# EAGLE design mainbrdV2 (EAGLE 5.10)
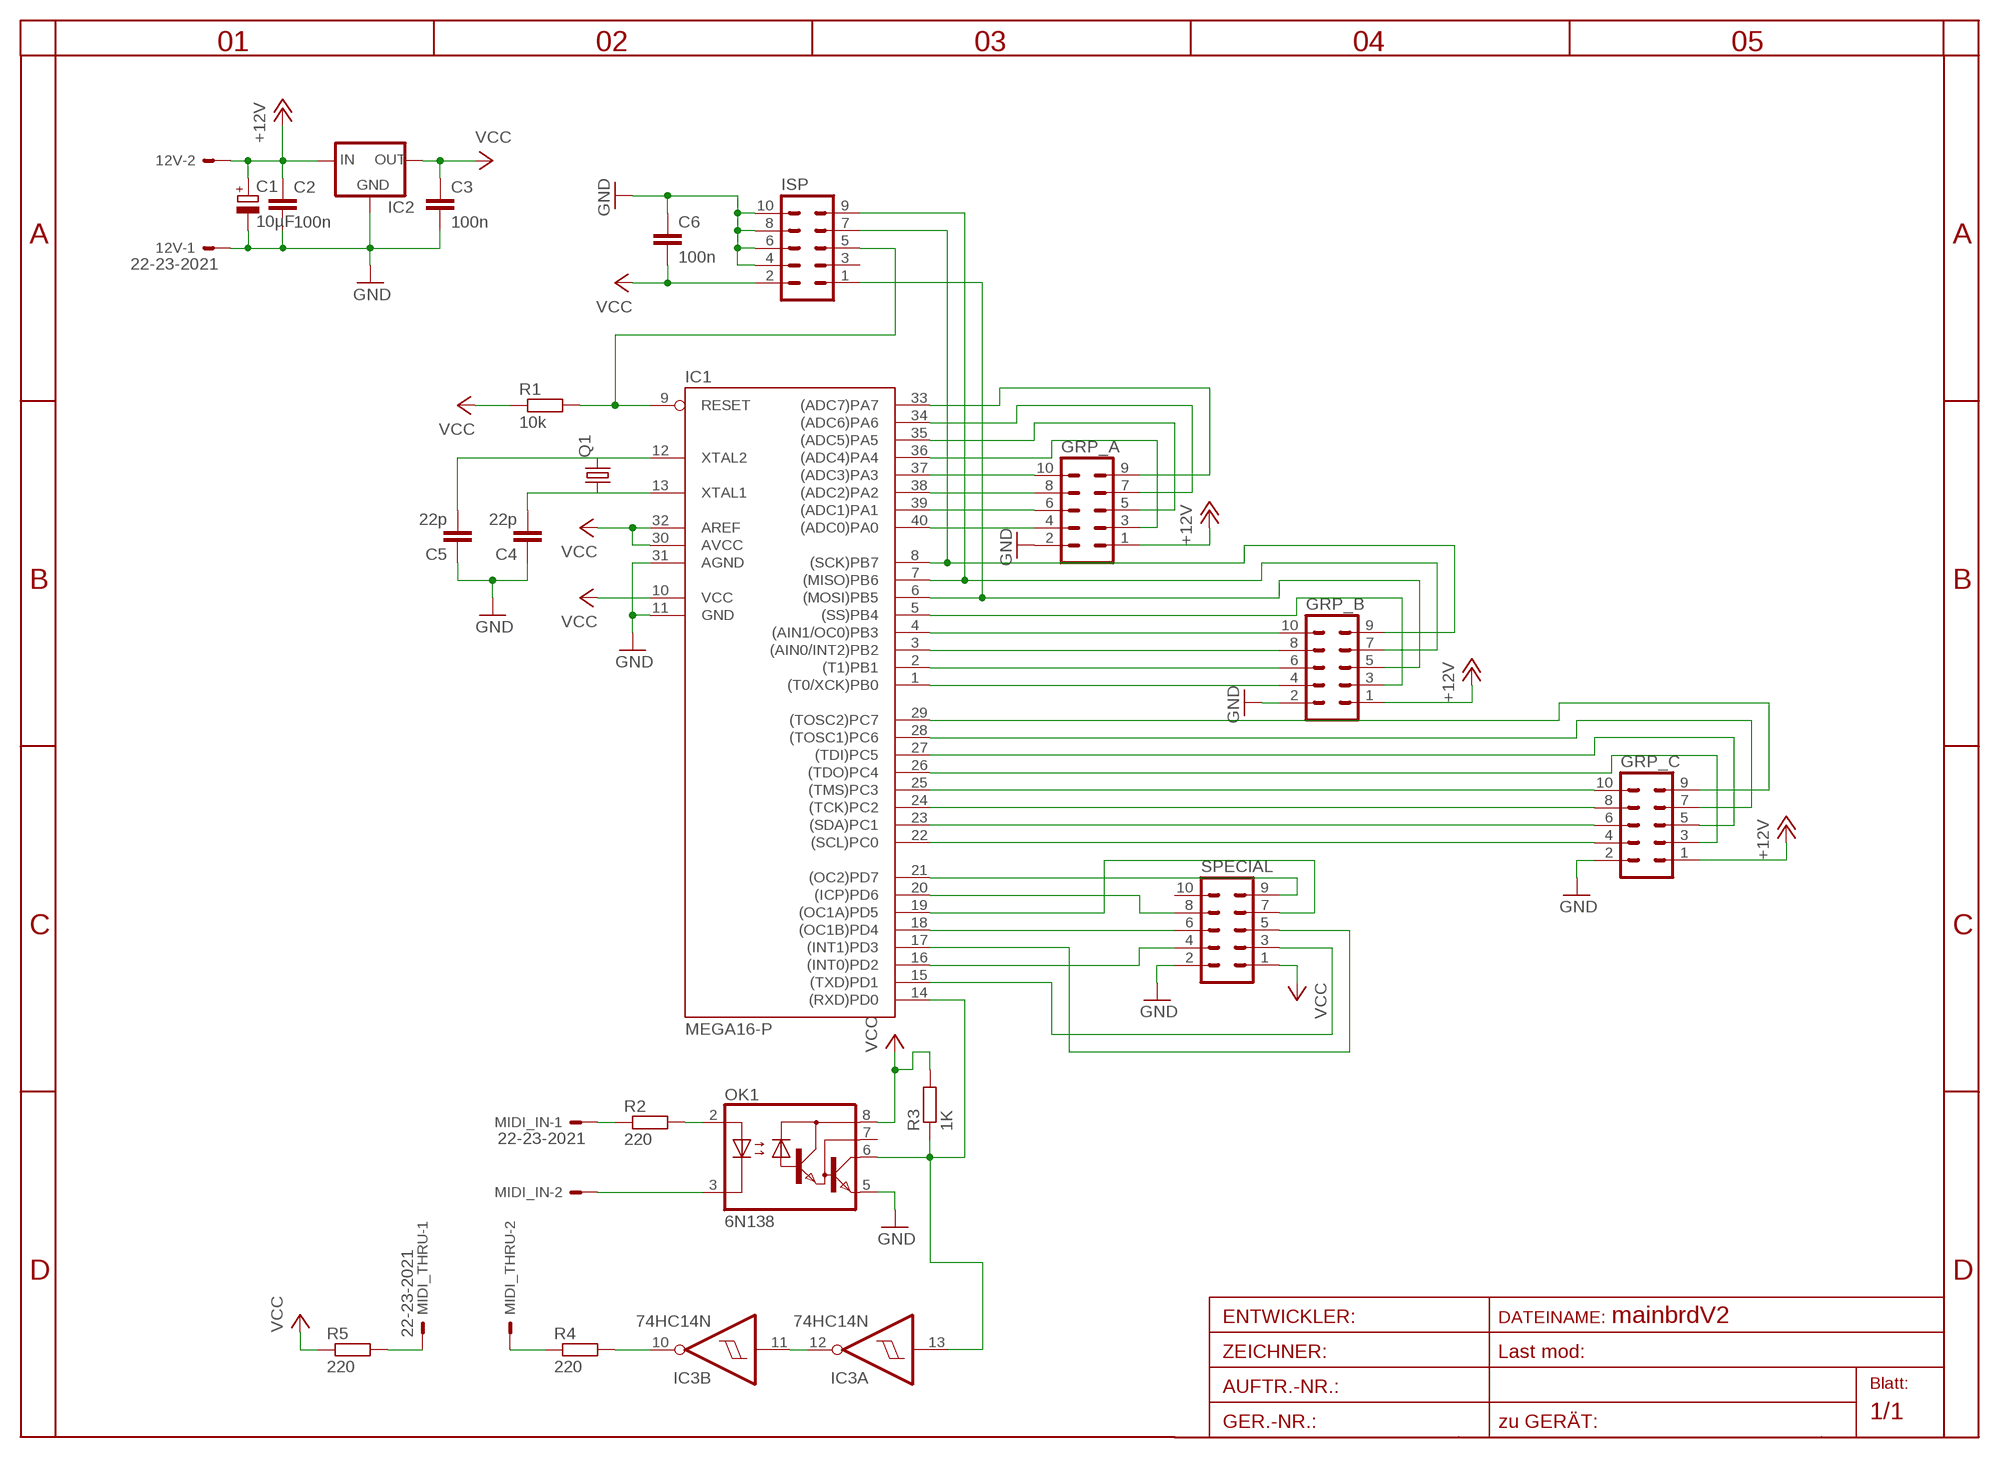
[diagram p0: schematic, sheet 1]

## Parts
12V  22-23-2021  [22-23-2021]
C1  10µF  CPOL-EUE2.5-6  [E2,5-6]
C2  100n  C-EU025-024X044  [C025-024X044]
C3  100n  C-EU025-024X044  [C025-024X044]
C4  22p  C-EU025-024X044  [C025-024X044]
C5  22p  C-EU025-024X044  [C025-024X044]
C6  100n  C-EU025-024X044  [C025-024X044]
GRP_A  ML10  [ML10]
GRP_B  ML10  [ML10]
GRP_C  ML10  [ML10]
IC1  MEGA16-P  [DIL40]
IC2  78XXL  [78XXL]
IC3  74HC14N  [DIL14]
ISP  ML10  [ML10]
MIDI_IN  22-23-2021  [22-23-2021]
MIDI_THRU  22-23-2021  [22-23-2021]
OK1  6N138  [DIL08]
Q1  CRYSTALHC49S  [HC49/S]
R1  10k  R-EU_0207/10  [0207/10]
R2  220  R-EU_M1206  [M1206]
R3  1K  R-EU_M1206  [M1206]
R4  220  R-EU_0207/12  [0207/12]
R5  220  R-EU_0207/10  [0207/10]
SPECIAL  ML10  [ML10]

## Nets
+12V: 12V.2 C1.+ C2.1 GRP_A.1 GRP_B.1 GRP_C.1 IC2.IN
GND: 12V.1 C1.- C2.2 C3.2 C4.1 C5.1 C6.1 GRP_A.2 GRP_B.2 GRP_C.2 IC1.11(GND) IC1.31(AGND) IC2.GND ISP.4 ISP.6 ISP.8 ISP.10 OK1.5(GND) SPECIAL.2
N$1: IC1.9(RESET) ISP.5 R1.2
N$2: GRP_B.9 IC1.8((SCK)PB7) ISP.7
N$3: GRP_B.7 IC1.7((MISO)PB6) ISP.9
N$4: C5.2 IC1.12(XTAL2) Q1.2
N$5: C4.2 IC1.13(XTAL1) Q1.1
N$6: GRP_B.5 IC1.6((MOSI)PB5) ISP.1
N$7: GRP_A.4 IC1.40((ADC0)PA0)
N$8: GRP_A.6 IC1.39((ADC1)PA1)
N$9: GRP_A.8 IC1.38((ADC2)PA2)
N$10: GRP_A.10 IC1.37((ADC3)PA3)
N$11: GRP_A.3 IC1.36((ADC4)PA4)
N$12: GRP_A.5 IC1.35((ADC5)PA5)
N$13: GRP_A.7 IC1.34((ADC6)PA6)
N$14: GRP_A.9 IC1.33((ADC7)PA7)
N$15: GRP_B.4 IC1.1((T0/XCK)PB0)
N$16: GRP_B.6 IC1.2((T1)PB1)
N$17: GRP_B.8 IC1.3((AIN0/INT2)PB2)
N$18: GRP_B.10 IC1.4((AIN1/OC0)PB3)
N$19: GRP_B.3 IC1.5((SS)PB4)
N$20: GRP_C.4 IC1.22((SCL)PC0)
N$21: GRP_C.6 IC1.23((SDA)PC1)
N$22: GRP_C.8 IC1.24((TCK)PC2)
N$23: GRP_C.10 IC1.25((TMS)PC3)
N$24: GRP_C.3 IC1.26((TDO)PC4)
N$25: GRP_C.5 IC1.27((TDI)PC5)
N$26: GRP_C.7 IC1.28((TOSC1)PC6)
N$27: GRP_C.9 IC1.29((TOSC2)PC7)
N$28: MIDI_IN.1 R2.1
N$29: OK1.2(A) R2.2
N$30: MIDI_IN.2 OK1.3(C)
N$31: IC1.14((RXD)PD0) IC3.13(A:I) OK1.6(VO) R3.1
N$32: IC1.15((TXD)PD1) SPECIAL.3
N$33: IC1.16((INT0)PD2) SPECIAL.4
N$34: IC1.18((OC1B)PD4) SPECIAL.6
N$35: IC1.20((ICP)PD6) SPECIAL.8
N$36: IC1.21((OC2)PD7) SPECIAL.9
N$37: IC1.19((OC1A)PD5) SPECIAL.7
N$38: IC1.17((INT1)PD3) SPECIAL.5
N$39: IC3.11(B:I) IC3.12(A:O)
N$40: IC3.10(B:O) R4.2
N$41: MIDI_THRU.1 R5.2
N$42: MIDI_THRU.2 R4.1
VCC: C3.1 C6.2 IC1.10(VCC) IC1.30(AVCC) IC1.32(AREF) IC2.OUT ISP.2 OK1.8(VCC) R1.1 R3.2 R5.1 SPECIAL.1
Unconnected: IC3.1(D:I) IC3.2(D:O) IC3.3(E:I) IC3.4(E:O) IC3.5(F:I) IC3.6(F:O) IC3.8(C:O) IC3.9(C:I) ISP.3 OK1.7(VB) SPECIAL.10

## Power pins joined to a net without a drawn wire
GND: IC3.7(P:GND)
VCC: IC3.14(P:VCC)

## Library data of the parts
12V MIDI_IN MIDI_THRU = con-molex:22-23-2021: .100" (2.54mm) Center Header - 2 Pin
C1 = rcl:CPOL-EU: POLARIZED CAPACITOR, European symbol
C2-C6 = rcl:C-EU: CAPACITOR, European symbol
GRP_A GRP_B GRP_C ISP SPECIAL = con-harting-ml:ML10: HARTING
IC1 = atmel:MEGA16-P: MICROCONTROLLER 16 Kbytes FLASH 1 kbytes SRAM 512 bytes EEPROM USART 8-channel 10 bit ADC Source: avr.lbr
IC2 = v-reg:78XXL: VOLTAGE REGULATOR
IC3 = 74xx-eu:74*14: Hex schmitt trigger INVERTER
OK1 = optocoupler:6N138: MOTOROLA OPTO COUPLER
Q1 = crystal:CRYSTAL: CRYSTAL
R1-R5 = rcl:R-EU_: RESISTOR, European symbol

## Net classes
0 default: width 0.508 mm, drill 0.051 mm, clearance 0.127 mm
1 GND: width 0.762 mm

## Board
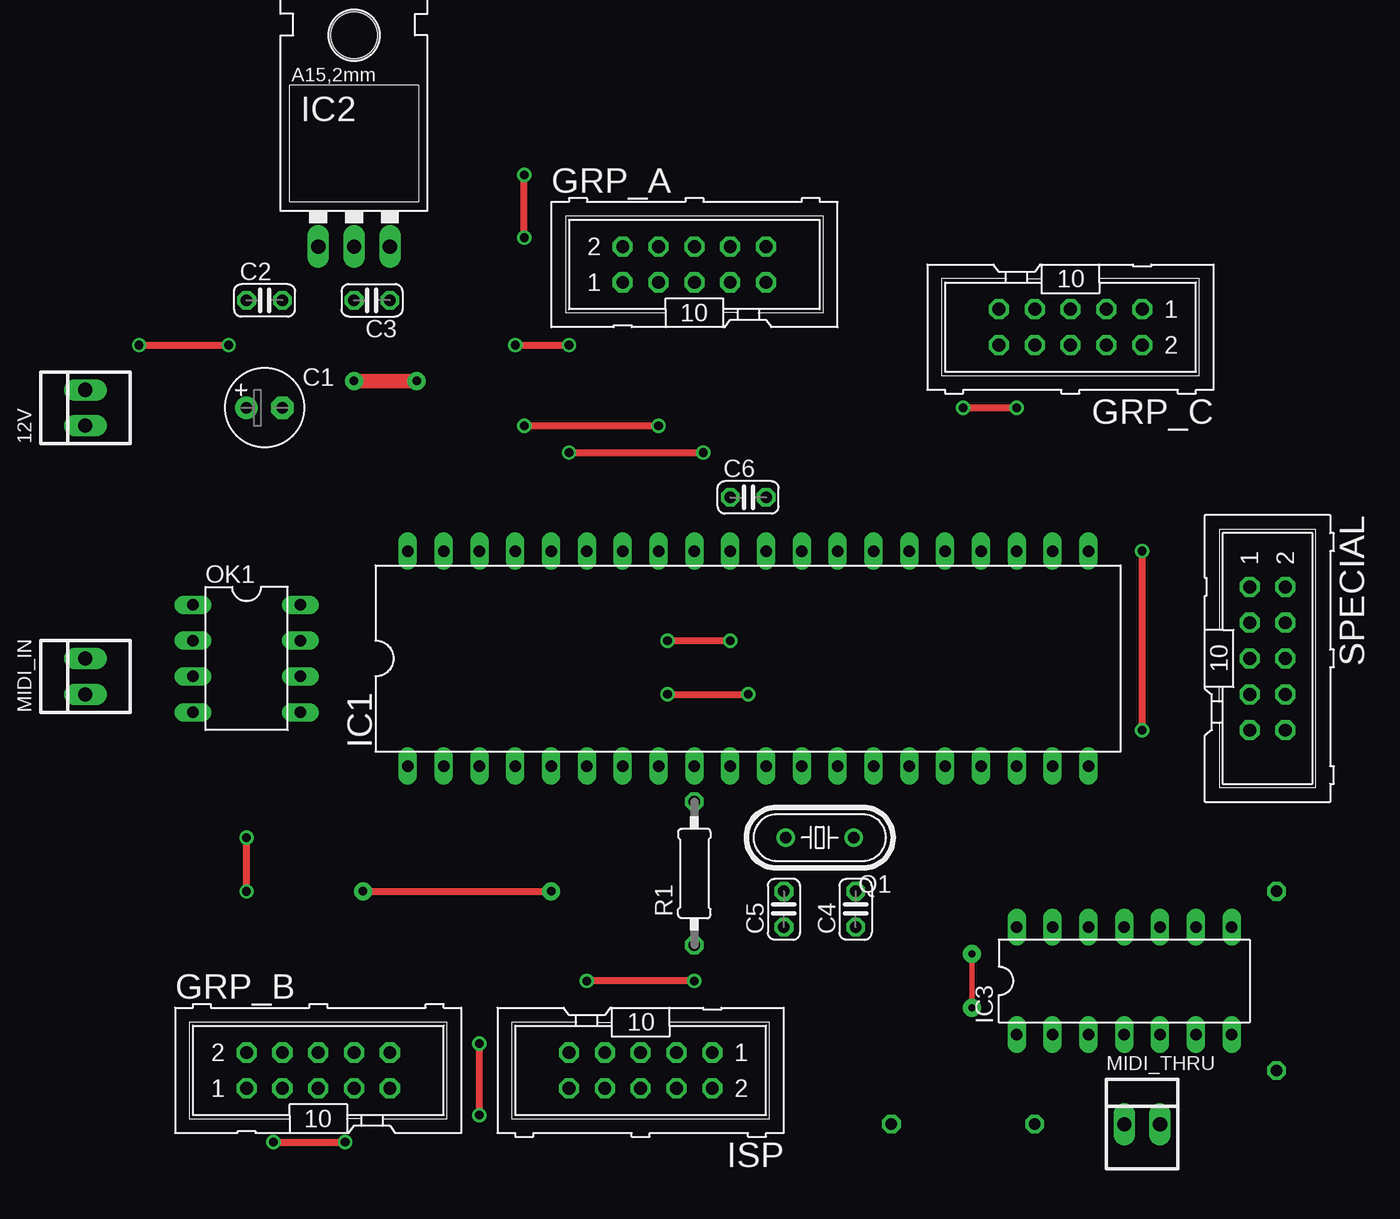
[diagram p1: board, top side]
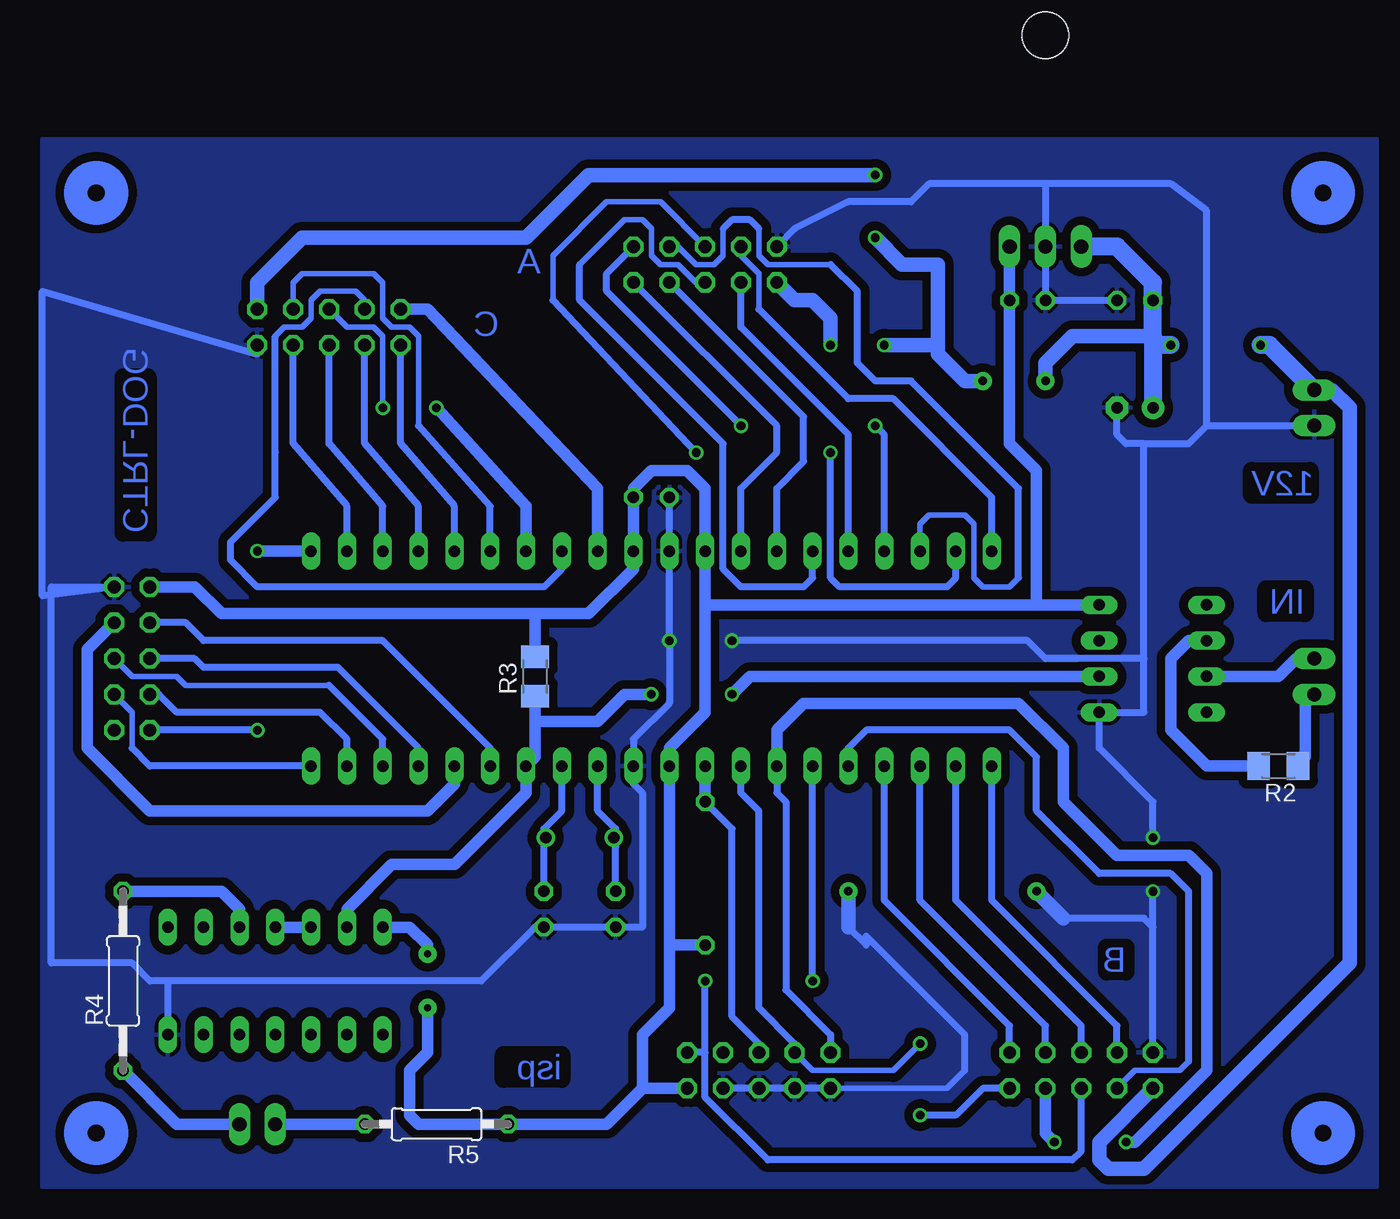
[diagram p2: board, bottom side, seen from below]

No outline drawn. Coordinates in mm, seen from the top.
Copper layers (1*16): Top 0.035mm / dielectric 1.5mm / Bottom 0.035mm
Design rules "default": minimum track width 10mil, minimum drill 24mil, track to track 8mil, track to pad 8mil, pad to pad 8mil, via to via 8mil, smd to smd 8mil, copper to edge 40mil, drill to drill 8mil, minimum pad ring 10mil, minimum via ring 8mil, stop-mask expansion 4mil, vias tented up to drill 0mil, thermal gap 10mil
tRestrict: area 11.4,4.4 to 31.8,12.1; area 33,4.4 to 53.3,12.1; area 85.1,27.3 to 92.7,47.6; area 64.8,57.1 to 85.1,64.8; area 38.1,61.6 to 58.4,69.2; area 26.7,43.8 to 77.5,46.4; area 26.7,28.6 to 77.5,31.1; area 11.4,32.4 to 14,42.5; area 19.1,32.4 to 21.6,42.5; area 15.2,54 to 20.3,56.5; area 71.1,17.1 to 88.9,19.7; area 71.1,9.5 to 88.9,12.1; 3 more areas

### Footprints (pad centres in the part's own frame; a part is rotated, then mirrored left to right if it is on the bottom)
22-23-2021 = drill 1 long: 1 -1.27,0; 2 1.27,0
E2,5-6 = drill 0.813 pad 1.6 round: + -1.27,0 | drill 0.813 pad 1.6 octagon: - 1.27,0
C025-024X044 = drill 0.813 octagon: 1 -1.27,0; 2 1.27,0
ML10 = drill 0.914 octagon: 1 -5.08,-1.27; 2 -5.08,1.27; 3 -2.54,-1.27; 4 -2.54,1.27; 5 0,-1.27; 6 0,1.27; 7 2.54,-1.27; 8 2.54,1.27; 9 5.08,-1.27; 10 5.08,1.27
DIL40 = drill 0.813 long: 1 -24.13,-7.62; 2 -21.59,-7.62; 3 -19.05,-7.62; 4 -16.51,-7.62; 5 -13.97,-7.62; 6 -11.43,-7.62; 7 -8.89,-7.62; 8 -6.35,-7.62; 9 -3.81,-7.62; 10 -1.27,-7.62; 11 1.27,-7.62; 12 3.81,-7.62; 13 6.35,-7.62; 14 8.89,-7.62; 15 11.43,-7.62; 16 13.97,-7.62; 17 16.51,-7.62; 18 19.05,-7.62; 19 21.59,-7.62; 20 24.13,-7.62; 21 24.13,7.62; 22 21.59,7.62; 23 19.05,7.62; 24 16.51,7.62; 25 13.97,7.62; 26 11.43,7.62; 27 8.89,7.62; 28 6.35,7.62; 29 3.81,7.62; 30 1.27,7.62; 31 -1.27,7.62; 32 -3.81,7.62; 33 -6.35,7.62; 34 -8.89,7.62; 35 -11.43,7.62; 36 -13.97,7.62; 37 -16.51,7.62; 38 -19.05,7.62; 39 -21.59,7.62; 40 -24.13,7.62
78XXL = drill 1.016 long: GND 0,-3.81; IN -2.54,-3.81; OUT 2.54,-3.81 | hole 3.302: 0,11.176
DIL14 = drill 0.813 long: 1 -7.62,-3.81; 2 -5.08,-3.81; 3 -2.54,-3.81; 4 0,-3.81; 5 2.54,-3.81; 6 5.08,-3.81; 7 7.62,-3.81; 8 7.62,3.81; 9 5.08,3.81; 10 2.54,3.81; 11 0,3.81; 12 -2.54,3.81; 13 -5.08,3.81; 14 -7.62,3.81
DIL08 = drill 0.813 long: 1 -3.81,-3.81; 2 -1.27,-3.81; 3 1.27,-3.81; 4 3.81,-3.81; 5 3.81,3.81; 6 1.27,3.81; 7 -1.27,3.81; 8 -3.81,3.81
HC49/S = drill 0.813 round: 1 -2.413,0; 2 2.413,0
0207/10 = drill 0.813 octagon: 1 -5.08,0; 2 5.08,0
M1206 = smd 1.6 x 2: 1 -1.4,0; 2 1.4,0
0207/12 = drill 0.813 octagon: 1 -6.35,0; 2 6.35,0

### Placement (x,y rotation side)
12V  5.08,55.24 90 top
C1  17.78,55.24 0 top
C2  17.78,62.87 0 top
C3  25.4,62.87 180 top
C4  59.69,19.68 90 top
C5  54.61,19.68 90 top
C6  52.07,48.9 0 top
GRP_A  48.26,65.41 0 top
GRP_B  21.59,8.26 0 top
GRP_C  74.93,60.96 180 top
IC1  52.07,37.47 0 top
IC2  24.13,70.48 0 top
IC3  78.74,14.61 0 top
ISP  44.45,8.26 180 top
MIDI_IN  5.08,36.2 90 top
MIDI_THRU  80.01,4.45 0 top
OK1  16.51,37.47 270 top
Q1  57.15,24.77 180 top
R1  48.26,22.23 90 top
R2  7.62,29.84 180 bottom
R3  60.33,36.2 90 bottom
R4  89.53,14.61 90 bottom
R5  67.31,4.45 180 bottom
SPECIAL  88.9,37.47 270 top

### Tracks (layer width: path | path; a pad name or v marks a point on that pad's centre or on a via)
+12V  (via drill 0.6 pad 1.27, 0.61)  (1 unrouted)
  Top 0.508: v35.56,59.69 v39.37,59.69 | v36.2,67.31 v36.2,71.75 | v8.89,59.69 v15.24,59.69
  Top 1.016: v24.13,57.15 28.57,57.15
  Bottom 0.508: IC2.IN 20.95,66.67
  Bottom 1.016: 12V.2 3.81,56.52 2.54,55.24 2.54,15.88 17.14,1.27 19.68,1.27 20.32,1.91 20.32,3.17 GRP_B.1 | v39.37,59.69 39.37,61.59 40.64,62.87 41.91,62.87 GRP_A.1 | 31.75,59.69 31.75,65.41 34.29,65.41 v36.2,67.31 | 31.75,59.69 v35.56,59.69 | GRP_C.1 80.01,64.14 76.83,67.31 60.96,67.31 56.52,71.75 v36.2,71.75 | 16.51,59.69 16.51,60.33 22.23,60.33 24.13,58.42 v24.13,57.15 | 31.75,59.69 31.75,59.05 29.84,57.15 28.57,57.15
  Bottom 1.27: C1.+ 16.51,59.69 v15.24,59.69 | v8.89,59.69 8.26,59.69 12V.2 | IC2.IN 19.05,66.67 16.51,64.14 C2.1 16.51,60.33
GND  (via drill 0.6 pad 1.27, 0.61)  (1 unrouted)
  Top 0.508: v16.51,20.95 v16.51,24.77 | v46.35,38.73 v50.8,38.73 | v24.77,20.95 38.1,20.95
  Bottom 0.406: 29.84,8.26 31.11,6.99 ISP.10
  Bottom 0.508: GRP_C.2 80.01,59.05 95.25,63.5 95.25,41.91 SPECIAL.2 94.61,42.55 94.61,15.88 88.9,15.88 87.63,14.61 86.36,14.61 | C6.1 IC1.31 v50.8,38.73 50.8,34.29 53.34,31.75 IC1.11 53.34,28.57 52.7,27.94 52.7,18.41 C5.1 C4.1 60.33,18.41 64.14,14.61 86.36,14.61 | 86.36,14.61 IC3.7 | ISP.4 ISP.6 ISP.8 ISP.10 | C2.2 C3.2 IC2.GND 24.13,71.12 | 24.13,71.12 32.38,71.12 33.66,69.85 38.1,69.85 41.91,67.94 GRP_A.2 | 17.14,37.47 17.14,52.7 | 17.14,37.47 17.14,33.66 OK1.5 20.32,31.11 16.51,27.3 v16.51,24.77 | 17.14,52.7 18.41,52.7 19.05,53.34 C1.- | 17.14,52.7 13.97,52.7 12.7,53.98 | 24.13,71.12 15.24,71.12 12.7,69.22 12.7,53.98 | 12.7,53.98 12V.1 | 16.51,18.41 v16.51,20.95 | 17.14,37.47 24.13,37.47 25.4,38.73 v46.35,38.73 | GRP_B.2 16.51,18.41 | 16.51,18.41 17.14,19.05 22.86,19.05 | 29.84,8.26 29.84,10.79 36.83,17.78 36.83,17.14 38.1,18.41
  Bottom 1.016: 22.86,19.05 v24.77,20.95 | 38.1,18.41 38.1,20.95
  pour Bottom (isolate 0.61): 0.64,0 0.64,74.3 95.25,74.3 95.25,0
N$1
  Bottom 0.508: ISP.5 44.45,10.16 46.35,12.06 46.35,25.4 R1.2
  Bottom 0.813: R1.2 IC1.9
N$2  (via drill 0.61)
  Top 0.508: v33.02,5.08 v33.02,10.16
  Bottom 0.406: v33.02,10.16 34.92,8.26 40.64,8.26 ISP.7
  Bottom 0.508: ISP.7 41.91,10.16 44.45,12.7 44.45,26.67 45.72,27.94 IC1.8 | v33.02,5.08 30.48,5.08 28.57,6.99 GRP_B.9
N$3  (via drill 0.61)
  Top 0.508: v18.41,3.17 v23.5,3.17
  Bottom 0.508: IC1.7 43.18,27.94 42.55,27.3 42.55,13.97 39.37,10.79 ISP.9
  Bottom 0.813: v23.5,3.17 24.13,3.81 GRP_B.7 | v18.41,3.17 17.78,3.17 12.7,8.26 12.7,22.23 13.97,23.5 19.05,23.5 22.86,27.3 22.86,31.11 26.04,34.29 41.27,34.29 43.18,32.38 IC1.7
N$4
  Bottom 0.508: C5.2 54.61,24.13 Q1.2 54.61,25.4 55.88,26.67 IC1.12
N$5
  Bottom 0.508: C4.2 59.69,24.13 Q1.1 59.69,25.4 58.42,26.67 IC1.13
N$6  (via drill 0.61)
  Top 0.508: v48.26,14.61 v40.64,14.61
  Bottom 0.508: 48.26,9.53 ISP.1 | 48.26,9.53 v48.26,14.61 | v40.64,14.61 IC1.6 | GRP_B.5 21.59,2.54 22.23,1.91 43.81,1.91 48.26,6.35 48.26,9.53
N$7
  Bottom 0.406: 44.45,62.23 44.45,64.77 45.72,66.04 GRP_A.4
  Bottom 0.508: 44.45,62.23 38.1,55.88 34.92,55.88 27.94,48.9 IC1.40
N$8  (via drill 0.61)
  Top 0.508: v39.37,52.07 v48.9,52.07
  Bottom 0.406: 59.05,62.87 59.05,66.04 55.24,69.85 51.44,69.85 GRP_A.6
  Bottom 0.508: v39.37,52.07 39.37,43.18 38.73,42.55 31.11,42.55 30.48,43.18 IC1.39 | v48.9,52.07 59.05,62.87
N$9
  Bottom 0.406: 26.04,43.18 26.67,42.55 28.57,42.55 29.21,43.18 29.21,46.99 29.84,47.62 32.38,47.62 33.02,46.99 IC1.38 | 39.37,65.41 43.81,65.41 44.45,66.04 44.45,67.94 | 46.99,67.94 46.99,66.04 47.62,65.41 48.9,65.41 50.16,66.67 GRP_A.8
  Bottom 0.508: 26.04,43.18 26.04,49.53 33.66,57.15 36.2,57.15 37.47,58.42 37.47,63.5 39.37,65.41 | 44.45,67.94 45.09,68.58 46.35,68.58 46.99,67.94
N$10  (via drill 0.61)
  Top 0.508: v36.2,53.98 v45.72,53.98
  Bottom 0.508: v45.72,53.98 55.24,63.5 55.24,64.77 GRP_A.10 | IC1.37 35.56,53.34 v36.2,53.98
N$11
  Bottom 0.508: IC1.36 38.1,53.34 45.72,60.96 GRP_A.3
N$12
  Bottom 0.406: 57.15,65.41 53.98,68.58 52.7,68.58 52.07,67.94 52.07,66.04 51.44,65.41 50.16,65.41 48.9,64.14 GRP_A.5
  Bottom 0.508: 57.15,65.41 57.15,62.87 46.99,52.7 46.99,43.81 45.72,42.55 41.27,42.55 40.64,43.18 IC1.35
N$13
  Bottom 0.508: GRP_A.7 41.27,54.61 41.27,51.44 43.18,49.53 IC1.34
N$14
  Bottom 0.508: GRP_A.9 43.18,53.98 43.18,52.07 45.72,49.53 IC1.33
N$15
  Bottom 0.508: IC1.1 27.94,20.32 19.05,11.43 GRP_B.4
N$16
  Bottom 0.508: IC1.2 30.48,20.32 21.59,11.43 GRP_B.6
N$17
  Bottom 0.508: IC1.3 33.02,20.32 24.13,11.43 GRP_B.8
N$18
  Bottom 0.508: GRP_B.10 26.67,11.43 35.56,20.32 IC1.4
N$19
  Bottom 0.406: 13.97,8.89 14.61,8.26 17.78,8.26 GRP_B.3
  Bottom 0.508: 13.97,8.89 13.97,20.95 15.24,22.23 20.32,22.23 24.77,26.67 24.77,30.48 26.67,32.38 36.83,32.38 38.1,31.11 IC1.5
N$20
  Bottom 0.508: IC1.22 73.66,48.26 77.47,52.7 GRP_C.4
N$21
  Bottom 0.508: IC1.23 71.12,48.26 74.93,52.7 GRP_C.6
N$22
  Bottom 0.508: IC1.24 68.58,48.26 72.39,52.7 GRP_C.8
N$23
  Bottom 0.508: IC1.25 66.04,48.26 69.85,52.7 GRP_C.10
N$24
  Bottom 0.406: 68.58,53.98 68.58,60.33 69.22,60.96 70.48,60.96 71.12,61.59 71.12,64.14 71.75,64.77 76.83,64.77 77.47,64.14 GRP_C.3
  Bottom 0.508: 68.58,53.98 63.5,48.26 IC1.26
N$25  (via drill 0.61)
  Top 0.508: v67.31,55.24 v71.12,55.24
  Bottom 0.406: v71.12,55.24 71.12,60.33 71.75,60.96 73.66,60.96 GRP_C.5
  Bottom 0.813: v67.31,55.24 60.96,48.26 IC1.27
N$26
  Bottom 0.406: 78.74,60.33 78.11,60.96 76.83,60.96 76.2,61.59 76.2,62.87 75.56,63.5 73.03,63.5 72.39,62.87 GRP_C.7
  Bottom 0.508: 78.74,60.33 78.74,52.07 78.74,48.9 81.92,45.72 81.92,44.45 80.01,42.55 59.69,42.55 58.42,43.81 IC1.28
N$27
  Bottom 0.813: IC1.29 55.88,49.53 67.94,62.23 GRP_C.9
N$28
  Bottom 0.813: R2.1 5.71,30.48 5.71,34.29 MIDI_IN.1
N$29
  Bottom 0.813: R2.2 12.7,29.84 15.24,32.38 15.24,37.47 13.97,38.73 OK1.2
N$30
  Bottom 0.813: OK1.3 7.62,36.2 6.35,37.47 MIDI_IN.2
N$31  (via drill 0.61)
  Top 0.508: v46.35,34.92 v52.07,34.92
  Bottom 0.813: 60.33,33.02 60.33,30.48 IC1.14 60.96,27.94 66.04,22.86 70.48,22.86 73.66,19.68 IC3.13 | 60.33,33.02 R3.1 | v46.35,34.92 45.09,36.2 OK1.6 | v52.07,34.92 53.98,34.92 55.88,33.02 60.33,33.02
N$32
  Bottom 0.508: SPECIAL.3 85.09,40.01 83.82,38.73 71.12,38.73 63.5,31.11 IC1.15
N$33
  Bottom 0.813: IC1.16 66.04,28.57 67.94,26.67 87.63,26.67 92.08,31.11 92.08,38.1 SPECIAL.4
N$34
  Bottom 0.406: 74.93,35.56 85.09,35.56 85.72,36.2 88.9,36.2 SPECIAL.6
  Bottom 0.508: IC1.18 71.12,31.75 74.93,35.56
N$35
  Bottom 0.406: 88.9,31.11 88.9,33.66 SPECIAL.8
  Bottom 0.508: 88.9,31.11 87.63,29.84 IC1.20
N$36  (via drill 0.61)
  Top 0.508: v80.01,32.38 v80.01,45.09
  Bottom 0.508: v80.01,32.38 SPECIAL.9
  Bottom 0.813: v80.01,45.09 IC1.21
N$37
  Bottom 0.508: IC1.19 73.66,31.75 75.56,33.66 85.72,33.66 87,34.92 SPECIAL.7
N$38
  Bottom 0.508: IC1.17 68.58,31.11 74.3,36.83 83.82,36.83 84.45,37.47 SPECIAL.5
N$39
  Bottom 0.813: IC3.12 IC3.11
N$40
  Bottom 0.813: R4.2 82.55,20.95 81.28,19.68 IC3.10
N$41
  Bottom 0.813: R5.2 MIDI_THRU.1
N$42
  Bottom 0.813: MIDI_THRU.2 85.72,4.45 R4.1
N$43  (via drill 0.6 pad 1.27)
  other vias: 24.13,57.15
N$44  (via drill 0.6 pad 1.27)
  other vias: 28.57,57.15
N$45  (via drill 0.6 pad 1.27)
  other vias: 24.77,20.95
N$46  (via drill 0.6 pad 1.27)
  other vias: 38.1,20.95
N$47  (via drill 0.5 pad 1.27)
  other vias: 67.94,16.51
N$48  (via drill 0.5 pad 1.27)
  other vias: 67.94,12.7
VCC  (via drill 0.5 pad 1.27)
  Top 0.406: v67.94,12.7 v67.94,16.51
  Bottom 0.406: 53.34,49.53 C6.2 IC1.30 53.34,43.81 | R3.2 60.33,37.47
  Bottom 0.813: IC2.OUT C3.1 26.67,52.7 24.77,50.8 24.77,41.27 | IC1.30 53.34,49.53 52.07,50.8 49.53,50.8 48.26,49.53 IC1.32 48.26,41.27 | 52.7,6.99 55.24,4.45 R5.1 68.58,4.45 69.22,5.08 69.22,8.26 67.94,9.53 v67.94,12.7 | 52.7,6.99 52.7,10.79 50.8,12.7 50.8,17.14 | 48.26,41.27 24.77,41.27 | 24.77,41.27 OK1.8 | 48.26,41.27 48.26,33.66 50.8,31.11 IC1.10 50.8,17.14 | 53.34,43.81 56.52,40.64 60.33,40.64 | 60.33,40.64 82.55,40.64 84.45,42.55 SPECIAL.1 | 60.33,40.64 R3.2 | 50.8,17.14 R1.1 | IC3.14 69.22,18.41 67.94,17.14 v67.94,16.51 | ISP.2 52.7,6.99
(copper drawn outside any net)
  shapes: Bottom circle x4

### Text on the board
Bottom: A | C | 12V | CTRL-DOG | IN | B | isp